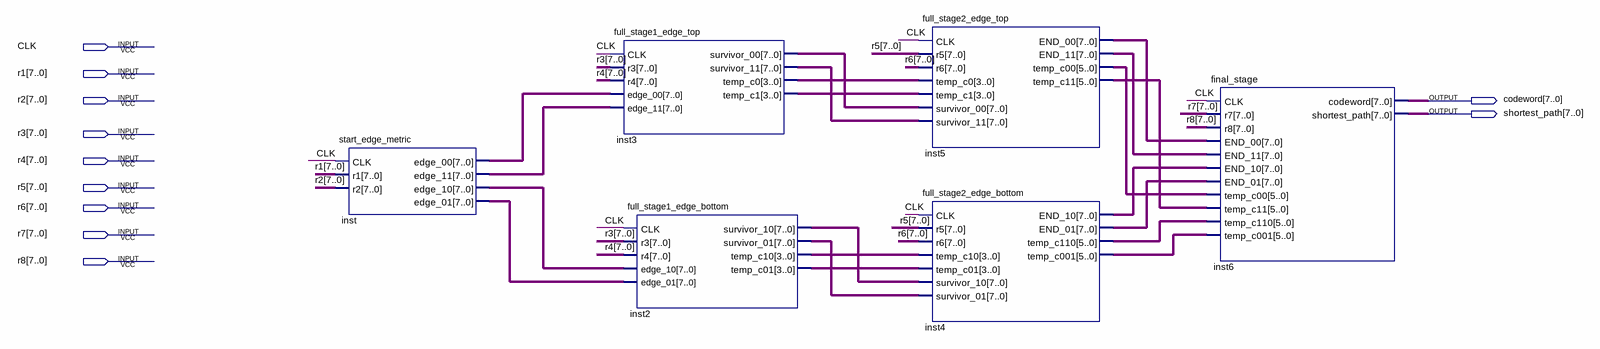
[diagram p0: schematic sheet]
// Quartus schematic Viterbi_decoder_block.bdf as structural Verilog: 6 symbols, 11 pins
module Viterbi_decoder_block (
  input  CLK,
  input  [7:0] r1,
  input  [7:0] r2,
  input  [7:0] r3,
  input  [7:0] r4,
  input  [7:0] r5,
  input  [7:0] r6,
  input  [7:0] r7,
  input  [7:0] r8,
  output [7:0] codeword,
  output [7:0] shortest_path
);

  wire [3:0] inst2_temp_c01, inst2_temp_c10, inst3_temp_c0, inst3_temp_c1;
  wire [5:0] inst4_temp_c001, inst4_temp_c110, inst5_temp_c00, inst5_temp_c11;
  wire [7:0] inst2_survivor_01, inst2_survivor_10, inst3_survivor_00, inst3_survivor_11, inst4_end_01,
       inst4_end_10, inst5_end_00, inst5_end_11, inst_edge_00, inst_edge_01, inst_edge_10, inst_edge_11;

  start_edge_metric inst (
    .CLK(CLK), .r1(r1), .r2(r2), .edge_00(inst_edge_00), .edge_11(inst_edge_11), .edge_10(inst_edge_10),
    .edge_01(inst_edge_01));
  full_stage1_edge_top inst3 (
    .CLK(CLK), .r3(r3), .r4(r4), .edge_00(inst_edge_00), .edge_11(inst_edge_11),
    .survivor_00(inst3_survivor_00), .survivor_11(inst3_survivor_11), .temp_c0(inst3_temp_c0),
    .temp_c1(inst3_temp_c1));
  full_stage1_edge_bottom inst2 (
    .CLK(CLK), .r3(r3), .r4(r4), .edge_10(inst_edge_10), .edge_01(inst_edge_01),
    .survivor_10(inst2_survivor_10), .survivor_01(inst2_survivor_01), .temp_c10(inst2_temp_c10),
    .temp_c01(inst2_temp_c01));
  full_stage2_edge_top inst5 (
    .CLK(CLK), .r5(r5), .r6(r6), .temp_c0(inst3_temp_c0), .temp_c1(inst3_temp_c1),
    .survivor_00(inst3_survivor_00), .survivor_11(inst3_survivor_11), .END_00(inst5_end_00),
    .END_11(inst5_end_11), .temp_c00(inst5_temp_c00), .temp_c11(inst5_temp_c11));
  full_stage2_edge_bottom inst4 (
    .CLK(CLK), .r5(r5), .r6(r6), .temp_c10(inst2_temp_c10), .temp_c01(inst2_temp_c01),
    .survivor_10(inst2_survivor_10), .survivor_01(inst2_survivor_01), .END_10(inst4_end_10),
    .END_01(inst4_end_01), .temp_c110(inst4_temp_c110), .temp_c001(inst4_temp_c001));
  final_stage inst6 (
    .CLK(CLK), .r7(r7), .r8(r8), .END_00(inst5_end_00), .END_11(inst5_end_11), .END_10(inst4_end_10),
    .END_01(inst4_end_01), .temp_c00(inst5_temp_c00), .temp_c11(inst5_temp_c11), .temp_c110(inst4_temp_c110),
    .temp_c001(inst4_temp_c001), .codeword(codeword), .shortest_path(shortest_path));
endmodule
